# EAGLE design Mechatronics Pneumatic controller (EAGLE 8.2.1)
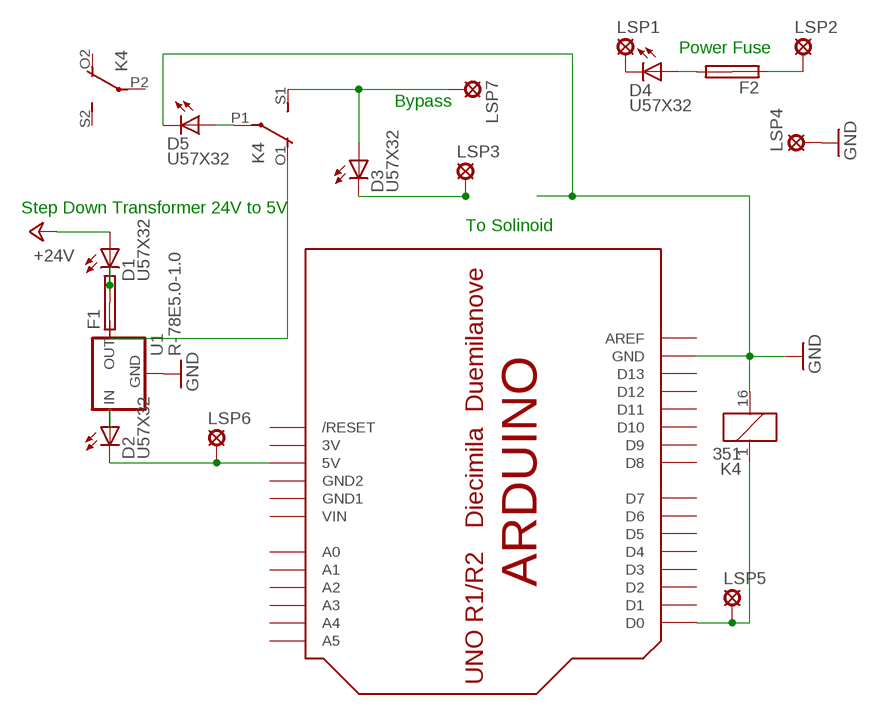
[diagram p0: schematic, sheet 1]

## Parts
D1  U57X32  [U57X32]
D2  U57X32  [U57X32]
D3  U57X32  [U57X32]
D4  U57X32  [U57X32]
D5  U57X32  [U57X32]
F1  SHK20L  [SHK20L]
F2  SHK20L  [SHK20L]
K4  351  [351]
LSP1  LSP10  [LSP10]
LSP2  LSP10  [LSP10]
LSP3  LSP10  [LSP10]
LSP4  LSP10  [LSP10]
LSP5  LSP10  [LSP10]
LSP6  LSP10  [LSP10]
LSP7  LSP10  [LSP10]
U1  R-78E5.0-1.0  [DC-DC_CONVERTER_78XX]
U$1  ARDUINOUNO  [ARDUINO]

## Nets
5VSOURCE: D2.K(C) LSP6.MP U$1.5V
+24V: D1.A
GND: D5.K(C) K4.16 LSP4.MP U1.GND U$1.GND
N$1: D1.K(C) F1.2A F1.2B
N$2: F1.1B U1.VOUT(OUT)
N$3: D2.A U1.VIN(IN)
N$4: K4.1 LSP5.MP U$1.D0
N$5: D3.A K4.S1(2:S) LSP7.MP
N$6: D3.K(C) LSP3.MP
N$7: D4.A F2.2A
N$8: F2.1A LSP2.MP
N$9: D4.K(C) LSP1.MP
N$11: D5.A K4.P1(2:P)
SOLINOID: F1.1A K4.O1(2:O)
Unconnected: F2.1B F2.2B K4.O2(3:O) K4.P2(3:P) K4.S2(3:S) U$1.A0 U$1.A1 U$1.A2 U$1.A3 U$1.A4 U$1.A5 U$1.AREF U$1.D1 U$1.D2 U$1.D3 U$1.D4 U$1.D5 U$1.D6 U$1.D7 U$1.D8 U$1.D9 U$1.D10 U$1.D11 U$1.D12 U$1.D13 U$1.RESET(/RESET)

## Notes on the sheet
- Power Fuse
- Bypass
- Step Down Transformer 24V to 5V
- To Solinoid

## Power pins joined to a net without a drawn wire
3V: U$1.3V
GND1: U$1.GND1
GND2: U$1.GND2
VIN: U$1.VIN

## Library data of the parts
D1-D5 = led:U57X32: LED rectangle, 5.7 x 3.2 mm
F1 F2 = fuse:SHK20L: FUSE HOLDER 5 x 20 mm, SH contact, SHH1 Schukat, E1073 Buerklin; OC_FARNELL: unknown; OC_NEWARK: unknown
K4 = relay:351: RELAY 2 x switch, Omron; OC_FARNELL: unknown; OC_NEWARK: unknown
LSP1-LSP7 = solpad:LSP10: SOLDER PAD drill 1.0 mm, distributor Buerklin, 12H555
U1 = SparkFun-IC-Power:R-78E5.0-1.0: Recom Power 5V 1A DC/DC Converter The Recom R-78E5.0-X.X is a compact DC/DC converter module that is a pin for pin drop-in replacement for the LM7805 linear voltage regulator. Specifications: Input Range: 7-28V Output Voltage: 5V Output Current: 1A Max Efficiency: 91% Datasheet <https://www.recom-power.com/pdf/Innoline/R-78Exx-1.0.pdf>; PROD_ID: COM-13655
U$1 = adafruit:ARDUINO: Arduino Diecimila/Duemilanove Make a shield with ease, this package has all the named pins as well as the two mounting drill holes and an outline of the USB and DC power connector. The outline is on the DIMENSION layer, so if your board house uses it they will cut the outline to match. http://www.ladyada.net/library/pcb/eaglelibrary.html

## Net classes
0 default: width 2 mm, drill 1 mm, clearance 0.5 mm

## Board
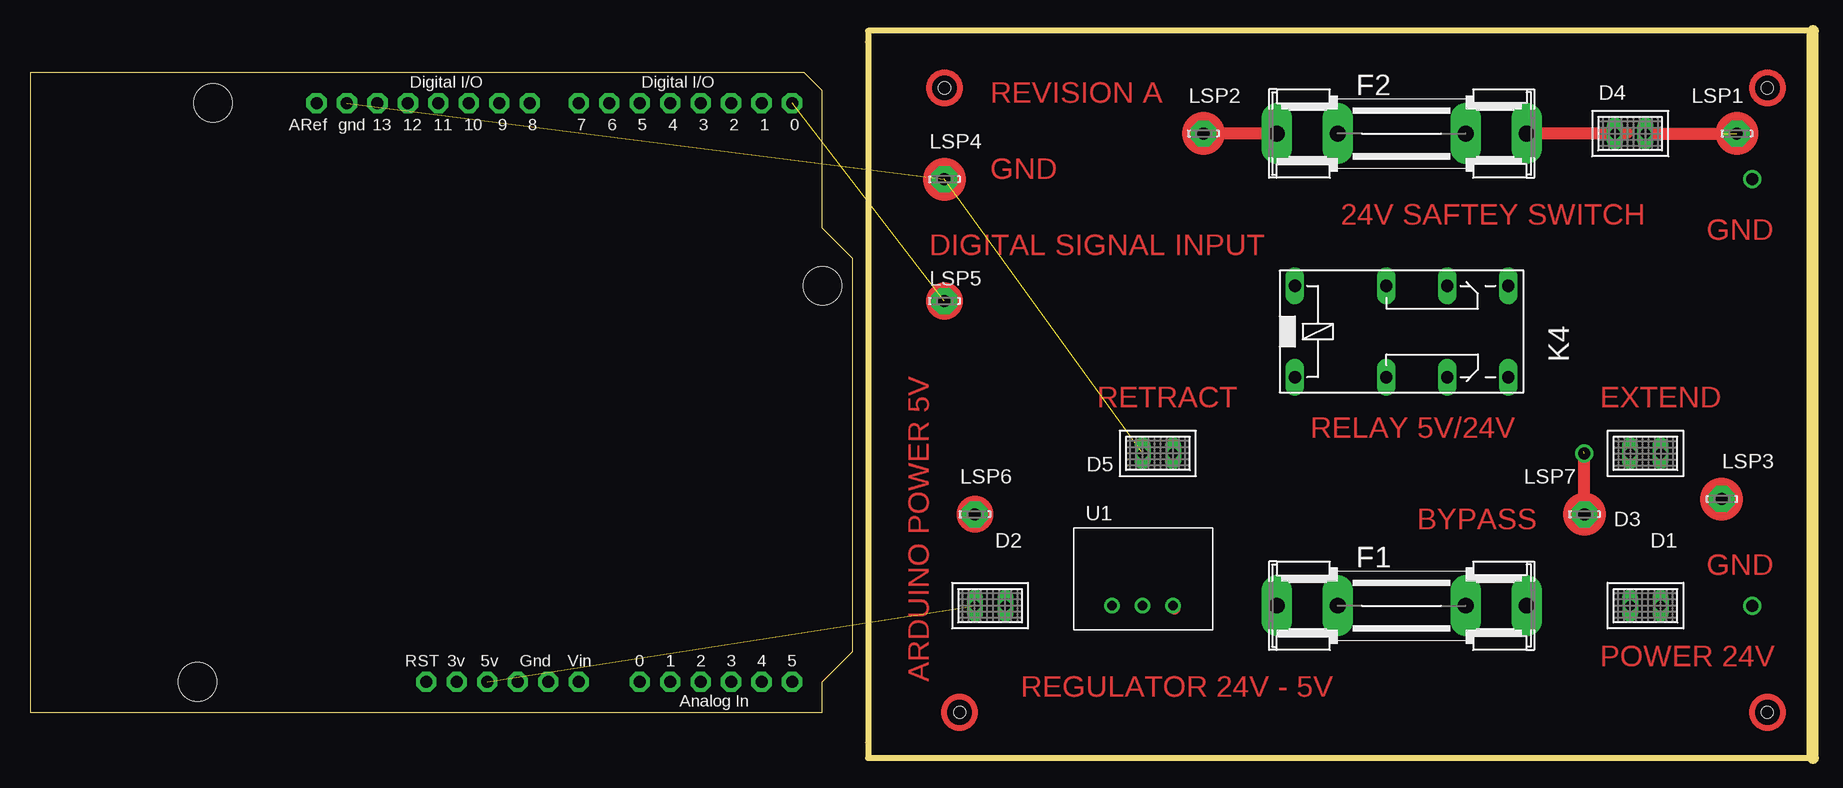
[diagram p1: board, top side]
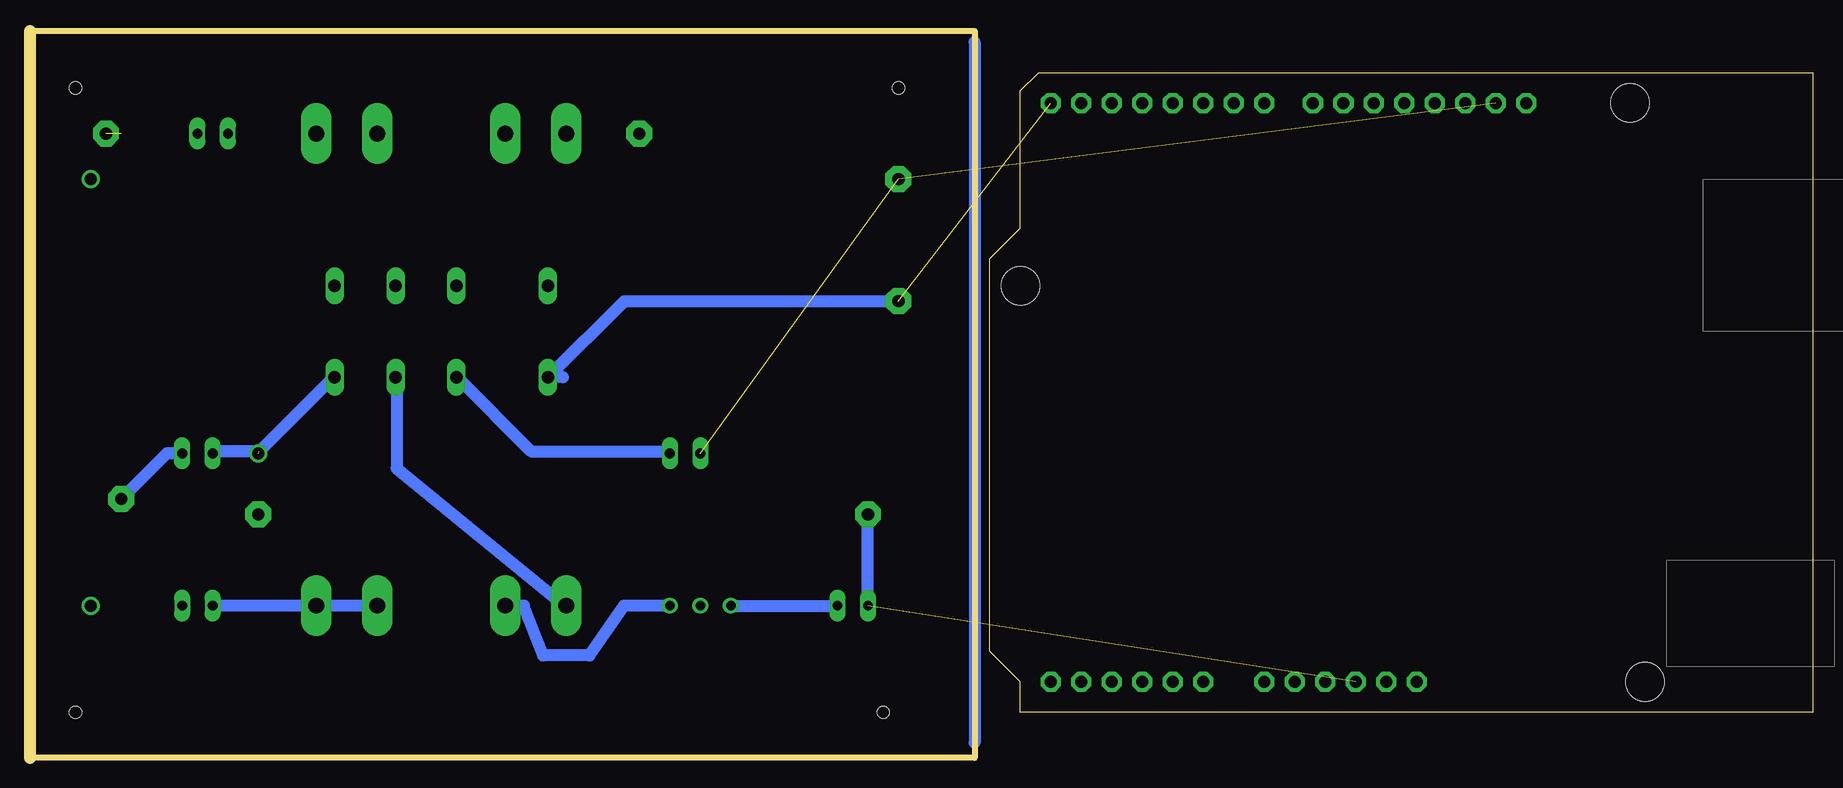
[diagram p2: board, bottom side, seen from below]

Size 78.72 x 60.63 mm. Coordinates in mm from the lower left corner, seen from the top.
Outline: 0,0 78.72,0 78.72,60.63 0,60.63 0,0
Copper layers (1*16): Top 0.035mm / dielectric 1.5mm / Bottom 0.035mm
Design rules "default": minimum track width 6mil, minimum drill 0.35mm, track to track 6mil, track to pad 6mil, pad to pad 6mil, via to via 6mil, smd to smd 6mil, copper to edge 40mil, drill to drill 6mil, minimum pad ring 10mil, minimum via ring 8mil, stop-mask expansion 4mil, vias tented up to drill 0mil, thermal gap 10mil
Holes 1 mm at 6.35,55.88 7.62,3.81 74.93,3.81 74.93,55.88

### Footprints (pad centres in the part's own frame; a part is rotated, then mirrored left to right if it is on the bottom)
U57X32 = drill 0.813 long: A -1.27,0; K 1.27,0
SHK20L = drill 1.321 pad 2.54 long: 1A -10.414,0; 1B -5.334,0; 2A 10.414,0; 2B 5.334,0
351 = drill 1.016 long: 1 -3.81,-3.81; 16 -3.81,3.81; O1 8.89,-3.81; O2 8.89,3.81; P1 3.81,-3.81; P2 3.81,3.81; S1 13.97,-3.81; S2 13.97,3.81
LSP10 = drill 1.016 pad 2.159 octagon: MP 0,0
DC-DC_CONVERTER_78XX = drill 0.8: GND 0,0; VIN -2.54,0; VOUT 2.54,0
ARDUINO = drill 1 pad 1.676 octagon: 3V 35.56,2.54; 5V 38.1,2.54; A0 50.8,2.54; A1 53.34,2.54; A2 55.88,2.54; A3 58.42,2.54; A4 60.96,2.54; A5 63.5,2.54; AREF 23.876,50.8; D0 63.5,50.8; D1 60.96,50.8; D2 58.42,50.8; D3 55.88,50.8; D4 53.34,50.8; D5 50.8,50.8; D6 48.26,50.8; D7 45.72,50.8; D8 41.656,50.8; D9 39.116,50.8; D10 36.576,50.8; D11 34.036,50.8; D12 31.496,50.8; D13 28.956,50.8; GND 26.416,50.8; GND1 43.18,2.54; GND2 40.64,2.54; RESET 33.02,2.54; VIN 45.72,2.54 | hole 3.2: 15.24,50.8; 66.04,35.56; 13.97,2.54

### Placement (x,y rotation side)
D1  64.77,12.7 180 top
D2  10.16,12.7 180 top
D3  64.77,25.4 0 top
D4  63.5,52.07 0 top
D5  24.13,25.4 180 top
F1  44.45,12.7 0 top
F2  44.45,52.07 0 top
K4  39.37,35.56 0 top
LSP1  72.39,52.07 0 top
LSP2  27.94,52.07 0 top
LSP3  71.12,21.59 0 top
LSP4  6.35,48.26 0 top
LSP5  6.35,38.1 0 top
LSP6  8.89,20.32 0 top
LSP7  59.69,20.32 0 top
U1  22.86,12.7 0 top
U$1  -69.85,3.81 0 top  (outside the outline)

### Tracks (layer width: path | path; a pad name or v marks a point on that pad's centre or on a via)
5VSOURCE  (via drill 1)  (1 unrouted)
  Bottom 1.016: D2.K LSP6.MP
  other vias: 8.89,20.32
GND  (2 unrouted)
N$1
  Bottom 1.016: D1.K F1.2A F1.2B
N$2
  Top 1.016: 25.53,12.45 U1.VOUT | 38.94,12.45 F1.1B
  Bottom 1.016: U1.VOUT 29.23,12.7 32.1,8.56 35.97,8.56 37.57,12.7 F1.1B
N$3
  Bottom 1.016: U1.VIN D2.A
N$4  (via drill 1)  (1 unrouted)
  Bottom 1.016: 34.29,31.75 K4.1 29.21,38.1 LSP5.MP
  other vias: 6.35,38.1
N$5  (via drill 1)  (1 unrouted)
  Top 1.016: LSP7.MP v59.69,25.4
  Bottom 1.016: D3.A 63.25,25.58 59.61,25.58 53.47,31.72 K4.S1
N$6  (via drill 1)
  Bottom 1.016: D3.K 67.31,25.4 LSP3.MP
  other vias: 71.12,21.59
N$7
  Top 1.016: D4.A 63.25,52.12 54.86,52.12 F2.2A
N$8
  Top 1.016: F2.1A LSP2.MP
N$9  (1 unrouted)
  Top 1.016: D4.K 71.12,52.07
N$10  (via drill 1)
  other vias: 73.66,12.7
N$11
  Bottom 1.016: D5.A 25.53,25.58 36.98,25.58 43.13,31.72 K4.P1
N$12  (via drill 1)
  other vias: 73.66,48.26
N$14  (via drill 1)
  other vias: 6.35,48.26
S$1
  Top 0.508: 0,59.69 0,1.27
S$2
  Bottom 1.016: 0,59.69 0,1.27
SOLINOID
  Bottom 1.016: K4.O1 48.16,31.72 48.16,24.16 34.19,12.72 F1.1A
(copper drawn outside any net)
  shapes: Top circle x11

### Text on the board
Top: REVISION A | GND | 24V SAFTEY SWITCH | GND | DIGITAL SIGNAL INPUT | RETRACT | EXTEND | RELAY 5V/24V | BYPASS | GND | POWER 24V | ARDUINO POWER 5V | REGULATOR 24V - 5V